# Altium schematic sheet Sheet1.SchDoc
size A; SheetNumber: 1; SheetTotal: 1; SPICEModelCacheDTECJXNW: <root> / <DocumentId>DTECJXNW</DocumentId> / <CacheFrame Number="0"> / <Model Name="cap" Kind="MDL"> / <Text>*Default semiconductor capacitor / .MODEL CAP C()</Text> / </Model> / <Model Name="npn" Kind="MDL"> / <Text>*Default NPN BJT / *NPN Trans Pinout: C,B,E / .MODEL NPN NPN()</Text> / </Model> / </CacheFrame> / </root>
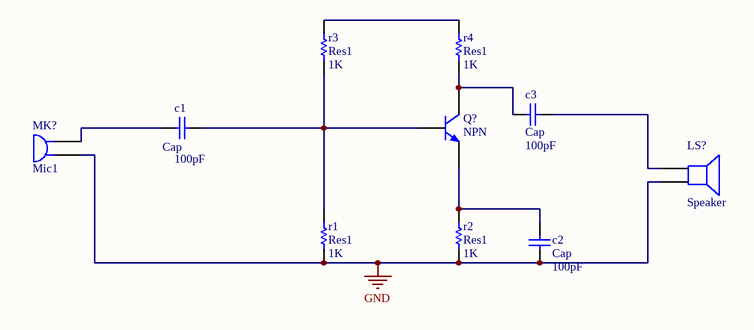
[diagram p0: Sheet1.SchDoc]

## Parts
c1  Cap  value 100pF  [RAD-0.3]
c2  Cap  value 100pF  [RAD-0.3]
c3  Cap  value 100pF  [RAD-0.3]
LS?  Speaker  [PIN2]
MK?  Mic1  [PIN2]
Q?  NPN  [TO-226-AA]
r1  Res1  value 1K  [AXIAL-0.3]
r2  Res1  value 1K  [AXIAL-0.3]
r3  Res1  value 1K  [AXIAL-0.3]
r4  Res1  value 1K  [AXIAL-0.3]

## Nets
GND: c2.1 LS?.2 MK?.1 r1.1 r2.1
Netc1_1: c1.1 MK?.2
Netc1_2: c1.2 Q?.2(B) r1.2 r3.1
Netc2_2: c2.2 Q?.3(E) r2.2
Netc3_1: c3.1 Q?.1(C) r4.1
Netc3_2: c3.2 LS?.1
Netr3_2: r3.2 r4.2

## Library data of the parts
c1-c3 = Cap: Capacitor; Published: 8-Jun-2000; LatestRevisionDate: 17-Jul-2002; LatestRevisionNote: Re-released for DXP Platform.; PackageReference: RAD-0.3; Publisher: Altium Limited; PackageDescription: Radial Cap, Thru-Hole; 2 Leads; 0.3 in Pin Spacing
LS? = Speaker: Loudspeaker; Published: 24-Mar-1999; LatestRevisionDate: 17-Jul-2002; LatestRevisionNote: Re-released for DXP Platform.; PackageReference: PIN2; Publisher: Altium Limited
MK? = Mic1: Microphone; Published: 24-Mar-1999; LatestRevisionDate: 17-Jul-2002; LatestRevisionNote: Re-released for DXP Platform.; PackageReference: PIN2; Publisher: Altium Limited
Q? = NPN: NPN Bipolar Transistor; Published: 8-Jun-2000; LatestRevisionDate: 17-Jul-2002; LatestRevisionNote: Re-released for DXP Platform.; PackageReference: TO-226-AA; Publisher: Altium Limited; PackageDescription: TO, Flat Index; 3 In-Line, Axial Leads; Body Dia. 4.8mm; Leads 0.55 x 0.51 mm (max); Code_JEDEC: TO-226-AA
r1-r4 = Res1: Resistor; Published: 8-Jun-2000; LatestRevisionDate: 17-Jul-2002; LatestRevisionNote: Re-released for DXP Platform.; PackageReference: AXIAL-0.3; Publisher: Altium Limited; PackageDescription: Axial Device, Thru-Hole; 2 Leads; 0.3 in Pin Spacing